# Altium schematic sheet LED.SchDoc
size A4
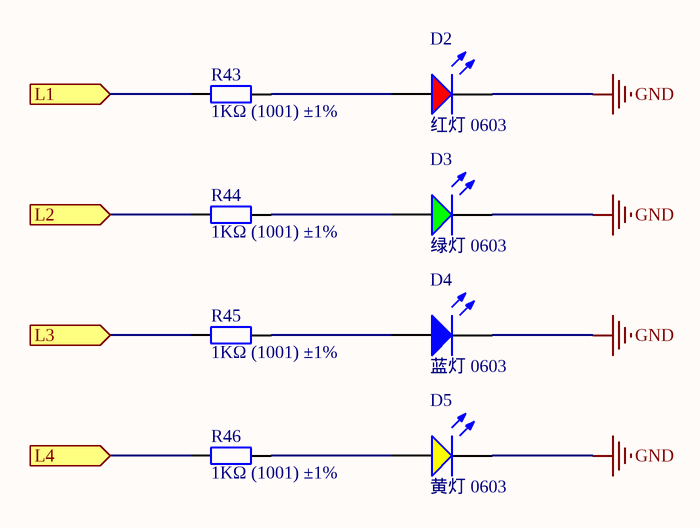
[diagram p0: LED.SchDoc]

## Parts
D2  红灯 0603  [0603_LED_S1]
D3  绿灯 0603  [0603_LED_S1]
D4  蓝灯 0603  [0603_LED_S1]
D5  黄灯 0603  [0603_LED_S1]
R43  1KΩ (1001) ±1%  [0402_R]
R44  1KΩ (1001) ±1%  [0402_R]
R45  1KΩ (1001) ±1%  [0402_R]
R46  1KΩ (1001) ±1%  [0402_R]

## Ports
L1 (in), L2 (in), L3 (in), L4 (in)

## Nets
GND: D2.K D3.K D4.K D5.K
L1: R43.1 ; port L1
L2: R44.1 ; port L2
L3: R45.1 ; port L3
L4: R46.1 ; port L4
NetD2_A: D2.A R43.2
NetD3_A: D3.A R44.2
NetD4_A: D4.A R45.2
NetD5_A: D5.A R46.2

## Library data of the parts
D2 = 0603 红灯: 发光二极管; ComponentLink1Description: 供应商链接; ComponentLink1URL: http://www.szlcsc.com/product/details_2659.html; Package: 0603; Supplier: LC; SuppliersPartNumber: C2286
D3 = 0603 绿灯: 发光二极管; ComponentLink1Description: 供应商链接; ComponentLink1URL: http://www.szlcsc.com/product/details_73152.html; Package: 0603; Supplier: LC; SuppliersPartNumber: C72043
D4 = 0603 蓝灯: 发光二极管; ComponentLink1Description: 供应商链接; ComponentLink1URL: http://www.szlcsc.com/product/details_73150.html; Package: 0603; Supplier: LC; SuppliersPartNumber: C72041
D5 = 0603 黄灯: 发光二极管; ComponentLink1Description: 供应商链接; ComponentLink1URL: http://www.szlcsc.com/product/details_73147.html; Package: 0603; Supplier: LC; SuppliersPartNumber: C72038
R43-R46 = 0402 1KΩ (1001) 1%: 贴片电阻; ComponentLink1Description: 供应商链接; ComponentLink1URL: http://www.szlcsc.com/product/details_12256.html; Package: 0402; Supplier: LC; SuppliersPartNumber: C11702